# EAGLE design USBasp1_3 (EAGLE 5.10)
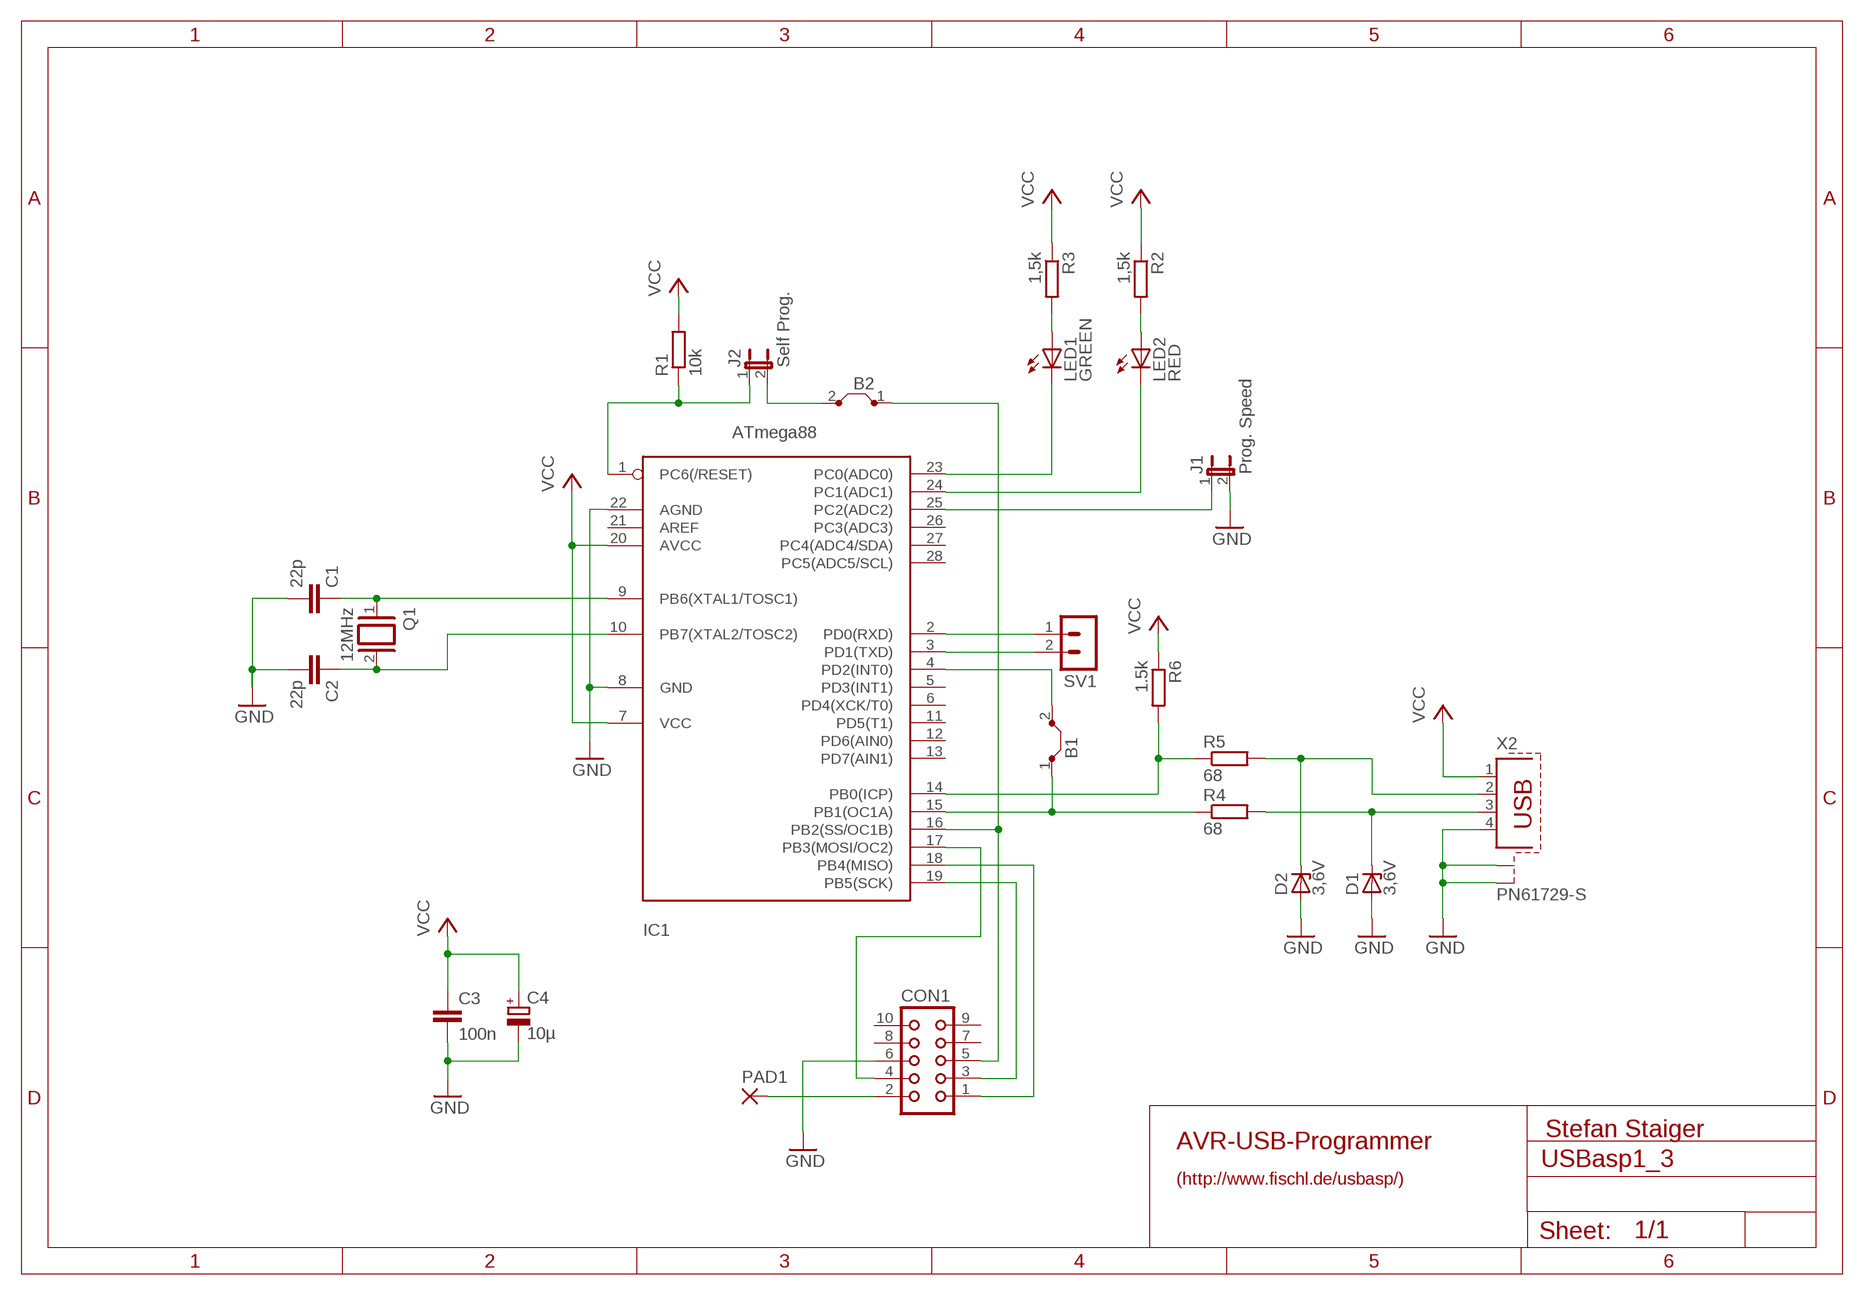
[diagram p0: schematic, sheet 1]

## Parts
B1  J24MM  [24]
B2  J24MM  [24]
C1  22p  C-EU025-025X050  [C025-025X050]
C2  22p  C-EU025-025X050  [C025-025X050]
C3  100n  C-EU050-024X044  [C050-024X044]
C4  10µ  CPOL-EUE2.5-5  [E2,5-5]
CON1  CON10PAD_LÄNGLICH  [CON10_2]
D1  3,6V  ZPD  [DO35Z10]
D2  3,6V  ZPD  [DO35Z10]
IC1  ATmega88  MEGA8-P  [DIL28-3]
J1  Prog. Speed  JP1E  [JP1]
J2  Self Prog.  JP1E  [JP1]
LED1  GREEN  LED3MM  [LED3MM]
LED2  RED  LED3MM  [LED3MM]
PAD1  1,6/0,9  [1,6/0,9]
Q1  12MHz  XTAL/S  [QS]
R1  10k  R-EU_0207/7  [0207/7]
R2  1,5k  R-EU_0207/7  [0207/7]
R3  1,5k  R-EU_0207/7  [0207/7]
R4  68  R-EU_0207/7  [0207/7]
R5  68  R-EU_0207/7  [0207/7]
R6  1.5k  R-EU_0207/7  [0207/7]
SV1  MA02-1GERADE  [MA02-1]
X2  PN61729-S  [PN61729-S]

## Nets
GND: C1.2 C2.2 C3.2 C4.- CON1.6 D1.A D2.A IC1.8(GND) IC1.22(AGND) J1.2 X2.4 X2.S1 X2.S2
N$1: C2.1 IC1.10(PB7(XTAL2/TOSC2)) Q1.2
N$2: C1.1 IC1.9(PB6(XTAL1/TOSC1)) Q1.1
N$3: IC1.1(PC6(/RESET)) J2.1 R1.1
N$4: IC1.25(PC2(ADC2)) J1.1
N$5: IC1.24(PC1(ADC1)) LED2.K(C)
N$6: LED2.A R2.2
N$7: LED1.A R3.2
N$8: IC1.23(PC0(ADC0)) LED1.K(C)
N$9: B1.1 IC1.15(PB1(OC1A)) R4.1
N$10: D1.C R4.2 X2.3
N$11: D2.C R5.2 X2.2
N$12: IC1.14(PB0(ICP)) R5.1 R6.2
N$13: CON1.1 IC1.18(PB4(MISO))
N$14: IC1.2(PD0(RXD)) SV1.1
N$15: IC1.3(PD1(TXD)) SV1.2
N$16: B2.2 J2.2
N$17: CON1.4 IC1.17(PB3(MOSI/OC2))
N$18: B1.2 IC1.4(PD2(INT0))
N$19: CON1.2 PAD1.1(P)
N$21: CON1.3 IC1.19(PB5(SCK))
N$22: B2.1 CON1.5 IC1.16(PB2(SS/OC1B))
VCC: C3.1 C4.+ IC1.7(VCC) IC1.20(AVCC) R1.2 R2.1 R3.1 R6.1 X2.1
Unconnected: CON1.7 CON1.8 CON1.9 CON1.10 IC1.5(PD3(INT1)) IC1.6(PD4(XCK/T0)) IC1.11(PD5(T1)) IC1.12(PD6(AIN0)) IC1.13(PD7(AIN1)) IC1.21(AREF) IC1.26(PC3(ADC3)) IC1.27(PC4(ADC4/SDA)) IC1.28(PC5(ADC5/SCL))

## Notes on the sheet
- Stefan Staiger
- AVR-USB-Programmer
- (http://www.fischl.de/usbasp/)

## Library data of the parts
B1 B2 = jumper:J: Bridge
C1-C3 = rcl:C-EU: CAPACITOR, European symbol
C4 = rcl:CPOL-EU: POLARIZED CAPACITOR, European symbol
CON1 = FHO-Projekt:CON10: CONNECTOR
D1 D2 = diode:ZPD: Z DIODE 500 mW
IC1 = avr:MEGA8-P: MICROCONTROLLER 8 Kbytes FLASH 1 kbytes SRAM 512 bytes EEPROM USART 4-channel 10 bit ADC 2-channel 8 bit ADC
J1 J2 = jumper:JP1E: JUMPER
LED1 LED2 = led:LED: LED OSRAM: - CHIPLED LG R971, LG N971, LY N971, LG Q971, LY Q971, LO R971, LY R971 LH N974, LH R974 LS Q976, LO Q976, LY Q976 LO Q996 - Hyper CHIPLED LW Q18S LB Q993, LB Q99A, LB R99A - SideLED LS A670, LO A670, LY A670, LG A670, LP A670 LB A673, LV A673, LT A673, LW A673 LH A674 LY A675 LS A676, LA A676, LO A676, LY A676, LW A676 LS A679, LY A679, LG A679 - Hyper Micro SIDELED® LS Y876, LA Y876, LO Y876, LY Y876 LT Y87S - SmartLED LW L88C, LW L88S LB L89C, LB L89S, LG L890 LS L89K, LO L89K, LY L89K LS L896, LA L896, LO L896, LY L896 - TOPLED LS T670, LO T670, LY T670, LG T670, LP T670 LSG T670, LSP T670, LSY T670, LOP T670, LYG T670 LG T671, LOG T671, LSG T671 LB T673, LV T673, LT T673, LW T673 LH T674 LS T676, LA T676, LO T676, LY T676, LB T676, LH T676, LSB T676, LW T676 LB T67C, LV T67C, LT T67C, LS T67K, LO T67K, LY T67K, LW E67C LS E67B, LA E67B, LO E67B, LY E67B, LB E67C, LV E67C, LT E67C LW T67C LS T679, LY T679, LG T679 LS T770, LO T770, LY T770, LG T770, LP T770 LB T773, LV T773, LT T773, LW T773 LH T774 LS E675, LA E675, LY E675, LS T675 LS T776, LA T776, LO T776, LY T776, LB T776 LHGB T686 LT T68C, LB T68C - Hyper Mini TOPLED® LB M676 - Mini TOPLED Santana® LG M470 LS M47K, LO M47K, LY M47K Source: http://www.osram.convergy.de LUXEON: - LUMILED® LXK2-PW12-R00, LXK2-PW12-S00, LXK2-PW14-U00, LXK2-PW14-V00 LXK2-PM12-R00, LXK2-PM12-S00, LXK2-PM14-U00 LXK2-PE12-Q00, LXK2-PE12-R00, LXK2-PE12-S00, LXK2-PE14-T00, LXK2-PE14-U00 LXK2-PB12-K00, LXK2-PB12-L00, LXK2-PB12-M00, LXK2-PB14-N00, LXK2-PB14-P00, LXK2-PB14-Q00 LXK2-PR12-L00, LXK2-PR12-M00, LXK2-PR14-Q00, LXK2-PR14-R00 LXK2-PD12-Q00, LXK2-PD12-R00, LXK2-PD12-S00 LXK2-PH12-R00, LXK2-PH12-S00 LXK2-PL12-P00, LXK2-PL12-Q00, LXK2-PL12-R00 Source: www.luxeon.com KINGBRIGHT: KA-3528ASYC Source: www.kingbright.com
PAD1 = wirepad:1,6/0,9: THROUGH-HOLE PAD
Q1 = special:XTAL/S: CRYSTAL
R1-R6 = rcl:R-EU_: RESISTOR, European symbol
SV1 = 01-Steckverbinder:MA02-1
X2 = con-berg:PN61729-S: BERG USB connector

## Board
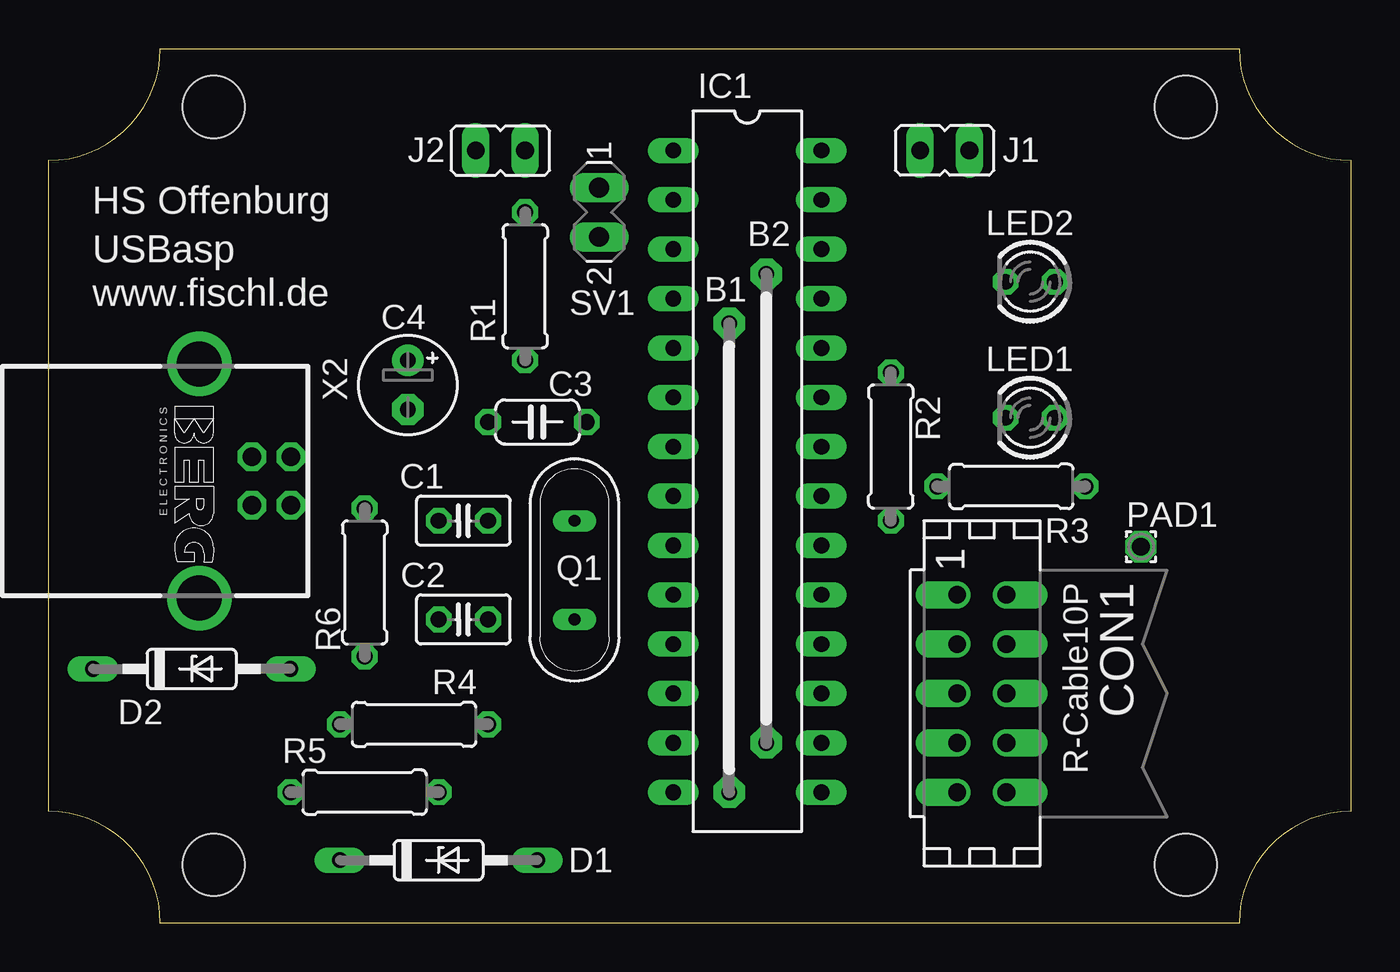
[diagram p1: board, top side]
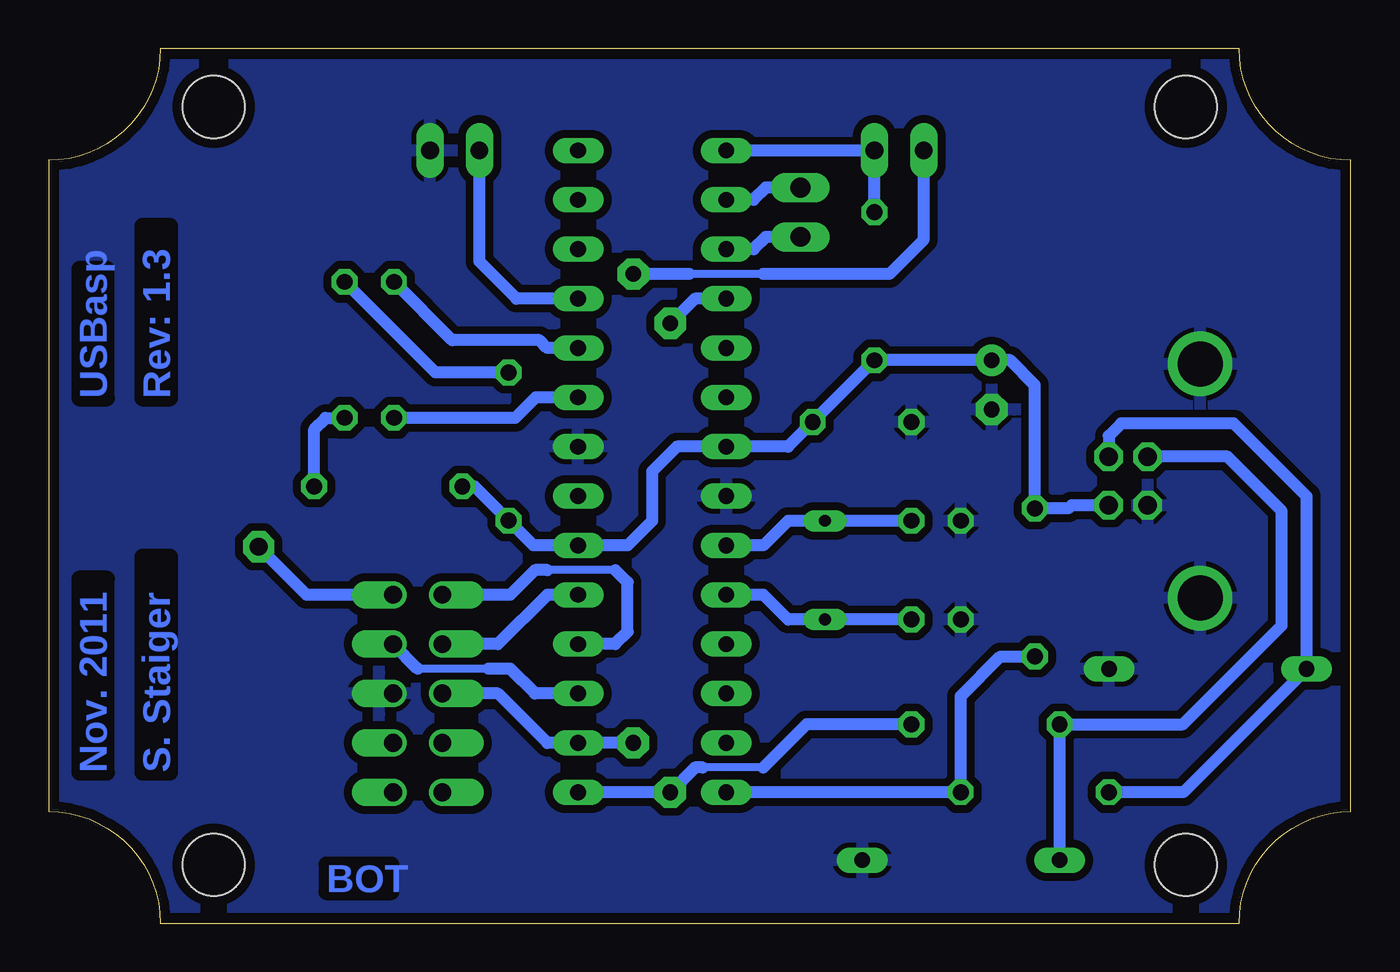
[diagram p2: board, bottom side, seen from below]

Size 67 x 45 mm. Coordinates in mm from the lower left corner, seen from the top.
Outline: 0,5.75 0,39.25 arc90 5.75,45 61.25,45 arc90 67,39.25 67,5.75 arc90 61.25,0 5.75,0 arc90 0,5.75
Copper layers (1*16): Top 0.035mm / dielectric 1.5mm / Bottom 0.035mm
Design rules "default *": minimum track width 0.2mm, minimum drill 0.6mm, track to track 0.2mm, track to pad 0.2mm, pad to pad 0.2mm, via to via 0.3mm, smd to smd 0.2mm, copper to edge 20mil, drill to drill 8mil, minimum pad ring 10mil, minimum via ring 8mil, stop-mask expansion 4mil, vias tented up to drill 0mil, thermal gap 10mil
Holes 3.2 mm at 8.5,42 58.5,3 58.5,42 8.5,3

### Footprints (pad centres in the part's own frame; a part is rotated, then mirrored left to right if it is on the bottom)
24 = drill 0.813 pad 1.6 octagon: 1 -12.065,0; 2 12.065,0
C025-025X050 = drill 0.813 octagon: 1 -1.27,0; 2 1.27,0
C050-024X044 = drill 0.813 octagon: 1 -2.54,0; 2 2.54,0
E2,5-5 = drill 0.813 pad 1.6 round: + -1.27,0 | drill 0.813 pad 1.6 octagon: - 1.27,0
CON10_2 = drill 0.914 pad 1.422 offset: 1 -5.08,-1.27; 2 -5.08,1.27; 3 -2.54,-1.27; 4 -2.54,1.27; 5 0,-1.27; 6 0,1.27; 7 2.54,-1.27; 8 2.54,1.27; 9 5.08,-1.27; 10 5.08,1.27
DO35Z10 = drill 0.813 long: A 5.08,0; C -5.08,0
DIL28-3 = drill 0.813 long: 1 -16.51,-3.81; 2 -13.97,-3.81; 3 -11.43,-3.81; 4 -8.89,-3.81; 5 -6.35,-3.81; 6 -3.81,-3.81; 7 -1.27,-3.81; 8 1.27,-3.81; 9 3.81,-3.81; 10 6.35,-3.81; 11 8.89,-3.81; 12 11.43,-3.81; 13 13.97,-3.81; 14 16.51,-3.81; 15 16.51,3.81; 16 13.97,3.81; 17 11.43,3.81; 18 8.89,3.81; 19 6.35,3.81; 20 3.81,3.81; 21 1.27,3.81; 22 -1.27,3.81; 23 -3.81,3.81; 24 -6.35,3.81; 25 -8.89,3.81; 26 -11.43,3.81; 27 -13.97,3.81; 28 -16.51,3.81
JP1 = drill 0.914 long: 1 0,-1.27; 2 0,1.27
LED3MM = drill 0.813 octagon: A -1.27,0; K 1.27,0
1,6/0,9 = drill 0.914 pad 1.6 octagon: 1 0,0
QS = drill 0.61 long: 1 -2.54,0; 2 2.54,0
0207/7 = drill 0.813 octagon: 1 -3.81,0; 2 3.81,0
MA02-1 = drill 1.016 long: 1 -1.27,0; 2 1.27,0
PN61729-S = drill 0.95 octagon: 1 1.25,4.71; 2 -1.25,4.71; 3 -1.25,2.71; 4 1.25,2.71 | drill 2.3 pad 2.9 round: S1 -6.02,0; S2 6.02,0

### Placement (x,y rotation side)
B1  35.02,18.8 90 top
B2  36.92,21.34 90 top
C1  21.34,20.7 180 top
C2  21.34,15.62 180 top
C3  25.15,25.79 180 top
C4  18.48,27.69 270 top
CON1  48.01,11.81 270 top
D1  20.06,3.24 0 top
D2  7.36,13.09 0 top
IC1  35.95,23.25 270 top
J1  46.1,39.76 270 top
J2  23.25,39.76 90 top
LED1  50.5,26 180 top
LED2  50.5,33 180 top
PAD1  56.2,19.37 0 top
Q1  27.05,18.16 270 top
R1  24.52,32.77 270 top
R2  43.33,24.52 90 top
R3  49.53,22.47 0 top
R4  18.8,10.23 180 top
R5  16.26,6.74 180 top
R6  16.26,17.53 270 top
SV1  28.32,36.58 270 top
X2  7.75,22.75 270 top

### Tracks (layer width: path | path; a pad name or v marks a point on that pad's centre or on a via)
GND
  pour Bottom (isolate 0.406): 0,0 0,45 67,45 67,0
N$1
  Bottom 0.61: C2.1 Q1.2 28.96,15.62 30.23,16.89 IC1.10
N$2
  Bottom 0.61: C1.1 Q1.1 28.96,20.7 30.23,19.43 IC1.9
N$3
  Bottom 0.61: IC1.1 J2.1 R1.1
N$4
  Bottom 0.61: IC1.25 42.93,32.13 44.84,34.04 J1.1
N$5
  Bottom 0.61: IC1.24 41.34,29.59 41.75,30 46.23,30 LED2.K
N$6
  Bottom 0.61: R2.2 47.1,28.33 LED2.A
N$7
  Bottom 0.61: LED1.A 52.75,26 53.34,25.41 R3.2
N$8
  Bottom 0.61: LED1.K 43,26 41.95,27.05 IC1.23
N$9
  Bottom 0.406: 30.23,8.01 33.34,8.01
  Bottom 0.61: R4.1 28.01,10.23 30.23,8.01 | 33.34,8.01 33.75,8.01 B1.1 IC1.15
N$10
  Bottom 0.61: X2.3 6.36,24 3.56,21.2 3.56,15.31 8.64,10.23 R4.2 D1.C
N$11
  Bottom 0.61: X2.2 12.46,25.07 11.81,25.72 6.03,25.72 2.29,21.98 2.28,21.98 D2.C 8.63,6.74 R5.2
N$12
  Bottom 0.61: IC1.14 R5.1 20.07,11.68 18.03,13.72 R6.2
N$13
  Bottom 0.406: 37.85,18.16 41.34,18.16
  Bottom 0.61: IC1.18 37.85,14.36 37.22,14.99 37.22,17.53 37.85,18.16 | 41.34,18.16 41.98,18.16 43.25,16.89 CON1.1
N$14
  Bottom 0.61: IC1.2 30.73,37.22 30.09,37.85 SV1.1
N$15
  Bottom 0.61: SV1.2 30.09,35.31 30.73,34.67 IC1.3
N$16
  Bottom 0.406: 30.23,33.41 34.04,33.41
  Bottom 0.61: 30.23,33.41 23.75,33.41 21.98,35.17 J2.2 | 34.04,33.41 B2.2
N$17
  Bottom 0.406: 44.38,13.09 48.01,13.09
  Bottom 0.61: IC1.17 41.98,11.81 43.25,13.09 44.38,13.09 | 48.01,13.09 CON1.4
N$18
  Bottom 0.61: IC1.4 33.75,32.13 B1.2
N$19
  Bottom 0.61: CON1.2 53.73,16.89 PAD1.1
N$21
  Bottom 0.61: IC1.19 41.34,16.89 43.88,14.36 CON1.3
N$22
  Bottom 0.61: CON1.5 43.88,11.81 41.34,9.28 IC1.16 B2.1
VCC
  Bottom 0.61: X2.1 14.38,21.5 14.54,21.34 R6.1 16.26,27.69 17.53,28.96 C4.+ R1.2 C3.1 28.96,24.52 IC1.7 34.67,24.52 35.95,23.25 35.95,20.7 37.22,19.43 IC1.20 42.06,19.43 R2.1 45.09,22.47 R3.1

### Text on the board
Bottom: Rev: 1.3 | USBasp | S. Staiger | Nov. 2011 | BOT
tPlace: 53mm x 35,5mm | 53mm x 28,5mm | HS Offenburg | USBasp | www.fischl.de